# Altium project HPBIController.PrjPCB (part 5 of 8)

## Sheet FPGAPower.SchDoc: 02290_Sonoma_Controller
size B; ApprovedBy: J Johnson; CheckedBy: J Johnson; Author: sdfasdfdfAEFfasdFfaF; DrawnBy: J Johnson; Organization: Opsero Electronic Design; Address1: 21-915 Av. Marguerite-Bourgeoys; Address2: Québec (QC); Address3: G1S 3X4; DocumentNumber: OP009-001-SCH; Revision: D-1; SheetNumber: 12; SheetTotal: 16; Tel1: (581) 308-8830; Tel2: (581) 308-8830; Project: 02290_Sonoma_Controller; CheckedDate: 2013-12-13; Sheet: Zynq Power Supplies; PageSetup: Record=PageOptions|CenterHorizontal=True|CenterVertical=True|PrintScale=1.08|XCorrection=1.00|YCorrection=1.00|PrintKind=0|BorderSize=5000000|LeftOffset=0|BottomOffset=0|Orientation=2|PaperLength=1000|PaperWidth=1000|Scale=100|PaperSource=7|PrintQuality=-4|MediaType=1|DitherType=10|PaperKind=Tabloid     [11 x 17 in]|PrintScaleMode=1; DrawDate: 2013-12-13; SchTitle: 02290_Sonoma_Controller; RevDescription: Replaced Q2,Q3 with STD16NF06LT4; RevDate: 2020-07-07; RevBy: J Johnson; RevDescription2: Added resistors to QSPI interface; ModifiedDate: 2020-07-07
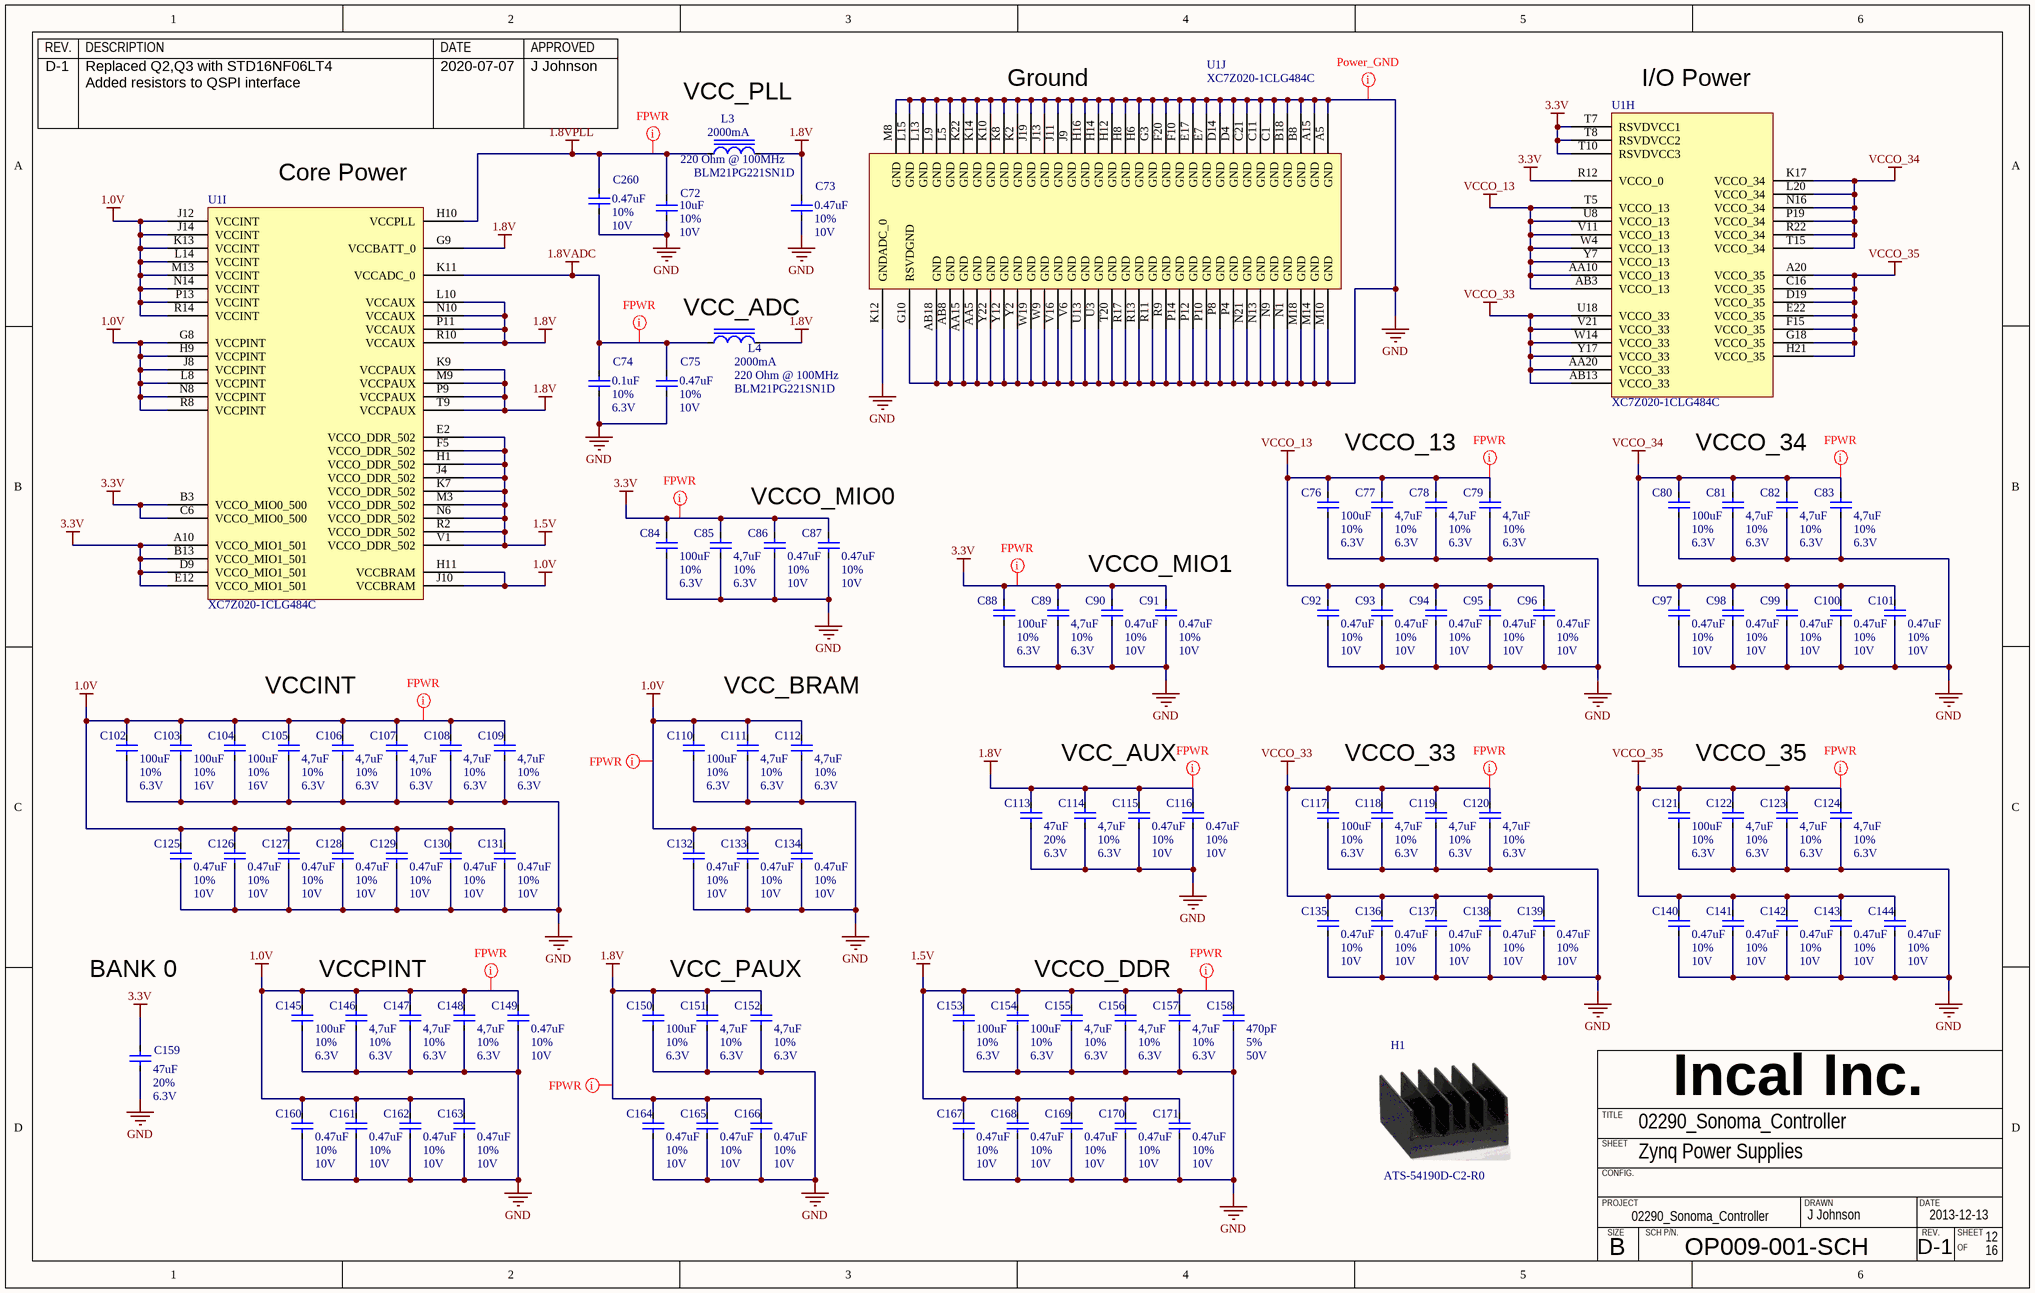
[diagram p8: FPGAPower.SchDoc]

### Parts
C72  value 10uF  Tolerance: 10%  Voltage: 10V  [CAPC1608X38N]  (hidden comment: CAPACITOR_NP_TYPE1)
C73  value 0.47uF  Tolerance: 10%  Voltage: 10V  [CAPC1005X55N]  (hidden comment: CAPACITOR_NP_TYPE1)
C74  value 0.1uF  Tolerance: 10%  Voltage: 6.3V  [CAPC0603X33N]  (hidden comment: CAPACITOR_NP_TYPE1)
C75  value 0.47uF  Tolerance: 10%  Voltage: 10V  [CAPC1005X55N]  (hidden comment: CAPACITOR_NP_TYPE1)
C76  value 100uF  Tolerance: 10%  Voltage: 6.3V  [CAPC3225X250N]  (hidden comment: CAPACITOR_NP_TYPE1)
C77  value 4,7uF  Tolerance: 10%  Voltage: 6.3V  [CAPC1005X33N]  (hidden comment: CAPACITOR_NP_TYPE1)
C78  value 4,7uF  Tolerance: 10%  Voltage: 6.3V  [CAPC1005X33N]  (hidden comment: CAPACITOR_NP_TYPE1)
C79  value 4,7uF  Tolerance: 10%  Voltage: 6.3V  [CAPC1005X33N]  (hidden comment: CAPACITOR_NP_TYPE1)
C80  value 100uF  Tolerance: 10%  Voltage: 6.3V  [CAPC3225X250N]  (hidden comment: CAPACITOR_NP_TYPE1)
C81  value 4,7uF  Tolerance: 10%  Voltage: 6.3V  [CAPC1005X33N]  (hidden comment: CAPACITOR_NP_TYPE1)
C82  value 4,7uF  Tolerance: 10%  Voltage: 6.3V  [CAPC1005X33N]  (hidden comment: CAPACITOR_NP_TYPE1)
C83  value 4,7uF  Tolerance: 10%  Voltage: 6.3V  [CAPC1005X33N]  (hidden comment: CAPACITOR_NP_TYPE1)
C84  value 100uF  Tolerance: 10%  Voltage: 6.3V  [CAPC3225X250N]  (hidden comment: CAPACITOR_NP_TYPE1)
C85  value 4,7uF  Tolerance: 10%  Voltage: 6.3V  [CAPC1005X33N]  (hidden comment: CAPACITOR_NP_TYPE1)
C86  value 0.47uF  Tolerance: 10%  Voltage: 10V  [CAPC1005X55N]  (hidden comment: CAPACITOR_NP_TYPE1)
C87  value 0.47uF  Tolerance: 10%  Voltage: 10V  [CAPC1005X55N]  (hidden comment: CAPACITOR_NP_TYPE1)
C88  value 100uF  Tolerance: 10%  Voltage: 6.3V  [CAPC3225X250N]  (hidden comment: CAPACITOR_NP_TYPE1)
C89  value 4,7uF  Tolerance: 10%  Voltage: 6.3V  [CAPC1005X33N]  (hidden comment: CAPACITOR_NP_TYPE1)
C90  value 0.47uF  Tolerance: 10%  Voltage: 10V  [CAPC1005X55N]  (hidden comment: CAPACITOR_NP_TYPE1)
C91  value 0.47uF  Tolerance: 10%  Voltage: 10V  [CAPC1005X55N]  (hidden comment: CAPACITOR_NP_TYPE1)
C92  value 0.47uF  Tolerance: 10%  Voltage: 10V  [CAPC1005X55N]  (hidden comment: CAPACITOR_NP_TYPE1)
C93  value 0.47uF  Tolerance: 10%  Voltage: 10V  [CAPC1005X55N]  (hidden comment: CAPACITOR_NP_TYPE1)
C94  value 0.47uF  Tolerance: 10%  Voltage: 10V  [CAPC1005X55N]  (hidden comment: CAPACITOR_NP_TYPE1)
C95  value 0.47uF  Tolerance: 10%  Voltage: 10V  [CAPC1005X55N]  (hidden comment: CAPACITOR_NP_TYPE1)
C96  value 0.47uF  Tolerance: 10%  Voltage: 10V  [CAPC1005X55N]  (hidden comment: CAPACITOR_NP_TYPE1)
C97  value 0.47uF  Tolerance: 10%  Voltage: 10V  [CAPC1005X55N]  (hidden comment: CAPACITOR_NP_TYPE1)
C98  value 0.47uF  Tolerance: 10%  Voltage: 10V  [CAPC1005X55N]  (hidden comment: CAPACITOR_NP_TYPE1)
C99  value 0.47uF  Tolerance: 10%  Voltage: 10V  [CAPC1005X55N]  (hidden comment: CAPACITOR_NP_TYPE1)
C100  value 0.47uF  Tolerance: 10%  Voltage: 10V  [CAPC1005X55N]  (hidden comment: CAPACITOR_NP_TYPE1)
C101  value 0.47uF  Tolerance: 10%  Voltage: 10V  [CAPC1005X55N]  (hidden comment: CAPACITOR_NP_TYPE1)
C102  value 100uF  Tolerance: 10%  Voltage: 6.3V  [CAPC3225X250N]  (hidden comment: CAPACITOR_NP_TYPE1)
C103  value 100uF  Tolerance: 10%  Voltage: 16V  [CAPC3225X250N]  (hidden comment: CAPACITOR_NP_TYPE1)
C104  value 100uF  Tolerance: 10%  Voltage: 16V  [CAPC3225X250N]  (hidden comment: CAPACITOR_NP_TYPE1)
C105  value 4,7uF  Tolerance: 10%  Voltage: 6.3V  [CAPC1005X33N]  (hidden comment: CAPACITOR_NP_TYPE1)
C106  value 4,7uF  Tolerance: 10%  Voltage: 6.3V  [CAPC1005X33N]  (hidden comment: CAPACITOR_NP_TYPE1)
C107  value 4,7uF  Tolerance: 10%  Voltage: 6.3V  [CAPC1005X33N]  (hidden comment: CAPACITOR_NP_TYPE1)
C108  value 4,7uF  Tolerance: 10%  Voltage: 6.3V  [CAPC1005X33N]  (hidden comment: CAPACITOR_NP_TYPE1)
C109  value 4,7uF  Tolerance: 10%  Voltage: 6.3V  [CAPC1005X33N]  (hidden comment: CAPACITOR_NP_TYPE1)
C110  value 100uF  Tolerance: 10%  Voltage: 6.3V  [CAPC3225X250N]  (hidden comment: CAPACITOR_NP_TYPE1)
C111  value 4,7uF  Tolerance: 10%  Voltage: 6.3V  [CAPC1005X33N]  (hidden comment: CAPACITOR_NP_TYPE1)
C112  value 4,7uF  Tolerance: 10%  Voltage: 6.3V  [CAPC1005X33N]  (hidden comment: CAPACITOR_NP_TYPE1)
C113  value 47uF  Tolerance: 20%  Voltage: 6.3V  [CAPC2013X125N]  (hidden comment: CAPACITOR_NP_TYPE1)
C114  value 4,7uF  Tolerance: 10%  Voltage: 6.3V  [CAPC1005X33N]  (hidden comment: CAPACITOR_NP_TYPE1)
C115  value 0.47uF  Tolerance: 10%  Voltage: 10V  [CAPC1005X55N]  (hidden comment: CAPACITOR_NP_TYPE1)
C116  value 0.47uF  Tolerance: 10%  Voltage: 10V  [CAPC1005X55N]  (hidden comment: CAPACITOR_NP_TYPE1)
C117  value 100uF  Tolerance: 10%  Voltage: 6.3V  [CAPC3225X250N]  (hidden comment: CAPACITOR_NP_TYPE1)
C118  value 4,7uF  Tolerance: 10%  Voltage: 6.3V  [CAPC1005X33N]  (hidden comment: CAPACITOR_NP_TYPE1)
C119  value 4,7uF  Tolerance: 10%  Voltage: 6.3V  [CAPC1005X33N]  (hidden comment: CAPACITOR_NP_TYPE1)
C120  value 4,7uF  Tolerance: 10%  Voltage: 6.3V  [CAPC1005X33N]  (hidden comment: CAPACITOR_NP_TYPE1)
C121  value 100uF  Tolerance: 10%  Voltage: 6.3V  [CAPC3225X250N]  (hidden comment: CAPACITOR_NP_TYPE1)
C122  value 4,7uF  Tolerance: 10%  Voltage: 6.3V  [CAPC1005X33N]  (hidden comment: CAPACITOR_NP_TYPE1)
C123  value 4,7uF  Tolerance: 10%  Voltage: 6.3V  [CAPC1005X33N]  (hidden comment: CAPACITOR_NP_TYPE1)
C124  value 4,7uF  Tolerance: 10%  Voltage: 6.3V  [CAPC1005X33N]  (hidden comment: CAPACITOR_NP_TYPE1)
C125  value 0.47uF  Tolerance: 10%  Voltage: 10V  [CAPC1005X55N]  (hidden comment: CAPACITOR_NP_TYPE1)
C126  value 0.47uF  Tolerance: 10%  Voltage: 10V  [CAPC1005X55N]  (hidden comment: CAPACITOR_NP_TYPE1)
C127  value 0.47uF  Tolerance: 10%  Voltage: 10V  [CAPC1005X55N]  (hidden comment: CAPACITOR_NP_TYPE1)
C128  value 0.47uF  Tolerance: 10%  Voltage: 10V  [CAPC1005X55N]  (hidden comment: CAPACITOR_NP_TYPE1)
C129  value 0.47uF  Tolerance: 10%  Voltage: 10V  [CAPC1005X55N]  (hidden comment: CAPACITOR_NP_TYPE1)
C130  value 0.47uF  Tolerance: 10%  Voltage: 10V  [CAPC1005X55N]  (hidden comment: CAPACITOR_NP_TYPE1)
C131  value 0.47uF  Tolerance: 10%  Voltage: 10V  [CAPC1005X55N]  (hidden comment: CAPACITOR_NP_TYPE1)
C132  value 0.47uF  Tolerance: 10%  Voltage: 10V  [CAPC1005X55N]  (hidden comment: CAPACITOR_NP_TYPE1)
C133  value 0.47uF  Tolerance: 10%  Voltage: 10V  [CAPC1005X55N]  (hidden comment: CAPACITOR_NP_TYPE1)
C134  value 0.47uF  Tolerance: 10%  Voltage: 10V  [CAPC1005X55N]  (hidden comment: CAPACITOR_NP_TYPE1)
C135  value 0.47uF  Tolerance: 10%  Voltage: 10V  [CAPC1005X55N]  (hidden comment: CAPACITOR_NP_TYPE1)
C136  value 0.47uF  Tolerance: 10%  Voltage: 10V  [CAPC1005X55N]  (hidden comment: CAPACITOR_NP_TYPE1)
C137  value 0.47uF  Tolerance: 10%  Voltage: 10V  [CAPC1005X55N]  (hidden comment: CAPACITOR_NP_TYPE1)
C138  value 0.47uF  Tolerance: 10%  Voltage: 10V  [CAPC1005X55N]  (hidden comment: CAPACITOR_NP_TYPE1)
C139  value 0.47uF  Tolerance: 10%  Voltage: 10V  [CAPC1005X55N]  (hidden comment: CAPACITOR_NP_TYPE1)
C140  value 0.47uF  Tolerance: 10%  Voltage: 10V  [CAPC1005X55N]  (hidden comment: CAPACITOR_NP_TYPE1)
C141  value 0.47uF  Tolerance: 10%  Voltage: 10V  [CAPC1005X55N]  (hidden comment: CAPACITOR_NP_TYPE1)
C142  value 0.47uF  Tolerance: 10%  Voltage: 10V  [CAPC1005X55N]  (hidden comment: CAPACITOR_NP_TYPE1)
C143  value 0.47uF  Tolerance: 10%  Voltage: 10V  [CAPC1005X55N]  (hidden comment: CAPACITOR_NP_TYPE1)
C144  value 0.47uF  Tolerance: 10%  Voltage: 10V  [CAPC1005X55N]  (hidden comment: CAPACITOR_NP_TYPE1)
C145  value 100uF  Tolerance: 10%  Voltage: 6.3V  [CAPC3225X250N]  (hidden comment: CAPACITOR_NP_TYPE1)
C146  value 4,7uF  Tolerance: 10%  Voltage: 6.3V  [CAPC1005X33N]  (hidden comment: CAPACITOR_NP_TYPE1)
C147  value 4,7uF  Tolerance: 10%  Voltage: 6.3V  [CAPC1005X33N]  (hidden comment: CAPACITOR_NP_TYPE1)
C148  value 4,7uF  Tolerance: 10%  Voltage: 6.3V  [CAPC1005X33N]  (hidden comment: CAPACITOR_NP_TYPE1)
C149  value 0.47uF  Tolerance: 10%  Voltage: 10V  [CAPC1005X55N]  (hidden comment: CAPACITOR_NP_TYPE1)
C150  value 100uF  Tolerance: 10%  Voltage: 6.3V  [CAPC3225X250N]  (hidden comment: CAPACITOR_NP_TYPE1)
C151  value 4,7uF  Tolerance: 10%  Voltage: 6.3V  [CAPC1005X33N]  (hidden comment: CAPACITOR_NP_TYPE1)
C152  value 4,7uF  Tolerance: 10%  Voltage: 6.3V  [CAPC1005X33N]  (hidden comment: CAPACITOR_NP_TYPE1)
C153  value 100uF  Tolerance: 10%  Voltage: 6.3V  [CAPC3225X250N]  (hidden comment: CAPACITOR_NP_TYPE1)
C154  value 100uF  Tolerance: 10%  Voltage: 6.3V  [CAPC3225X250N]  (hidden comment: CAPACITOR_NP_TYPE1)
C155  value 4,7uF  Tolerance: 10%  Voltage: 6.3V  [CAPC1005X33N]  (hidden comment: CAPACITOR_NP_TYPE1)
C156  value 4,7uF  Tolerance: 10%  Voltage: 6.3V  [CAPC1005X33N]  (hidden comment: CAPACITOR_NP_TYPE1)
C157  value 4,7uF  Tolerance: 10%  Voltage: 6.3V  [CAPC1005X33N]  (hidden comment: CAPACITOR_NP_TYPE1)
C158  value 470pF  Tolerance: 5%  Voltage: 50V  [CAPC1005X33N]  (hidden comment: CAPACITOR_NP_TYPE1)
C159  value 47uF  Tolerance: 20%  Voltage: 6.3V  [CAPC2013X125N]  (hidden comment: CAPACITOR_NP_TYPE1)
C160  value 0.47uF  Tolerance: 10%  Voltage: 10V  [CAPC1005X55N]  (hidden comment: CAPACITOR_NP_TYPE1)
C161  value 0.47uF  Tolerance: 10%  Voltage: 10V  [CAPC1005X55N]  (hidden comment: CAPACITOR_NP_TYPE1)
C162  value 0.47uF  Tolerance: 10%  Voltage: 10V  [CAPC1005X55N]  (hidden comment: CAPACITOR_NP_TYPE1)
C163  value 0.47uF  Tolerance: 10%  Voltage: 10V  [CAPC1005X55N]  (hidden comment: CAPACITOR_NP_TYPE1)
C164  value 0.47uF  Tolerance: 10%  Voltage: 10V  [CAPC1005X55N]  (hidden comment: CAPACITOR_NP_TYPE1)
C165  value 0.47uF  Tolerance: 10%  Voltage: 10V  [CAPC1005X55N]  (hidden comment: CAPACITOR_NP_TYPE1)
C166  value 0.47uF  Tolerance: 10%  Voltage: 10V  [CAPC1005X55N]  (hidden comment: CAPACITOR_NP_TYPE1)
C167  value 0.47uF  Tolerance: 10%  Voltage: 10V  [CAPC1005X55N]  (hidden comment: CAPACITOR_NP_TYPE1)
C168  value 0.47uF  Tolerance: 10%  Voltage: 10V  [CAPC1005X55N]  (hidden comment: CAPACITOR_NP_TYPE1)
C169  value 0.47uF  Tolerance: 10%  Voltage: 10V  [CAPC1005X55N]  (hidden comment: CAPACITOR_NP_TYPE1)
C170  value 0.47uF  Tolerance: 10%  Voltage: 10V  [CAPC1005X55N]  (hidden comment: CAPACITOR_NP_TYPE1)
C171  value 0.47uF  Tolerance: 10%  Voltage: 10V  [CAPC1005X55N]  (hidden comment: CAPACITOR_NP_TYPE1)
C260  value 0.47uF  Tolerance: 10%  Voltage: 10V  [CAPC1005X55N]  (hidden comment: CAPACITOR_NP_TYPE1)
H1  ATS-54190D-C2-R0  (mechanical)
L3  value 220 Ohm @ 100MHz  Current: 2000mA  Mfg Part Number 1: BLM21PG221SN1D  [INDC2012X85N]  (hidden comment: INDUCTOR_CORE_TYPE1)
L4  value 220 Ohm @ 100MHz  Current: 2000mA  Mfg Part Number 1: BLM21PG221SN1D  [INDC2012X85N]  (hidden comment: INDUCTOR_CORE_TYPE1)
U1  XC7Z020-1CLG484C  [CLG484]  (parts H,I,J of 10)

### Nets
1.0V: C102.1 C103.1 C104.1 C105.1 C106.1 C107.1 C108.1 C109.1 C110.1 C111.1 C112.1 C125.1 C126.1 C127.1 C128.1 C129.1 C130.1 C131.1 C132.1 C133.1 C134.1 C145.1 C146.1 C147.1 C148.1 C149.1 C160.1 C161.1 C162.1 C163.1 U1.G8(VCCPINT) U1.H9(VCCPINT) U1.H11(VCCBRAM) U1.J8(VCCPINT) U1.J10(VCCBRAM) U1.J12(VCCINT) U1.J14(VCCINT) U1.K13(VCCINT) U1.L8(VCCPINT) U1.L14(VCCINT) U1.M13(VCCINT) U1.N8(VCCPINT) U1.N14(VCCINT) U1.P13(VCCINT) U1.R8(VCCPINT) U1.R14(VCCINT)
1.5V: C153.1 C154.1 C155.1 C156.1 C157.1 C158.1 C167.1 C168.1 C169.1 C170.1 C171.1 U1.E2(VCCO_DDR_502) U1.F5(VCCO_DDR_502) U1.H1(VCCO_DDR_502) U1.J4(VCCO_DDR_502) U1.K7(VCCO_DDR_502) U1.M3(VCCO_DDR_502) U1.N6(VCCO_DDR_502) U1.R2(VCCO_DDR_502) U1.V1(VCCO_DDR_502)
1.8V: C73.1 C113.1 C114.1 C115.1 C116.1 C150.1 C151.1 C152.1 C164.1 C165.1 C166.1 L3.2 L4.2 U1.G9(VCCBATT_0) U1.K9(VCCPAUX) U1.L10(VCCAUX) U1.M9(VCCPAUX) U1.N10(VCCAUX) U1.P9(VCCPAUX) U1.P11(VCCAUX) U1.R10(VCCAUX) U1.T9(VCCPAUX)
1.8VADC: C74.1 C75.1 L4.1 U1.K11(VCCADC_0)
1.8VPLL: C72.1 C260.1 L3.1 U1.H10(VCCPLL)
3.3V: C84.1 C85.1 C86.1 C87.1 C88.1 C89.1 C90.1 C91.1 C159.1 U1.A10(VCCO_MIO1_501) U1.B3(VCCO_MIO0_500) U1.B13(VCCO_MIO1_501) U1.C6(VCCO_MIO0_500) U1.D9(VCCO_MIO1_501) U1.E12(VCCO_MIO1_501) U1.R12(VCCO_0) U1.T7(RSVDVCC1) U1.T8(RSVDVCC2) U1.T10(RSVDVCC3)
GND: C72.2 C73.2 C74.2 C75.2 C76.2 C77.2 C78.2 C79.2 C80.2 C81.2 C82.2 C83.2 C84.2 C85.2 C86.2 C87.2 C88.2 C89.2 C90.2 C91.2 C92.2 C93.2 C94.2 C95.2 C96.2 C97.2 C98.2 C99.2 C100.2 C101.2 C102.2 C103.2 C104.2 C105.2 C106.2 C107.2 C108.2 C109.2 C110.2 C111.2 C112.2 C113.2 C114.2 C115.2 C116.2 C117.2 C118.2 C119.2 C120.2 C121.2 C122.2 C123.2 C124.2 C125.2 C126.2 C127.2 C128.2 C129.2 C130.2 C131.2 C132.2 C133.2 C134.2 C135.2 C136.2 C137.2 C138.2 C139.2 C140.2 C141.2 C142.2 C143.2 C144.2 C145.2 C146.2 C147.2 C148.2 C149.2 C150.2 C151.2 C152.2 C153.2 C154.2 C155.2 C156.2 C157.2 C158.2 C159.2 C160.2 C161.2 C162.2 C163.2 C164.2 C165.2 C166.2 C167.2 C168.2 C169.2 C170.2 C171.2 C260.2 U1.A5(GND) U1.A15(GND) U1.AA5(GND) U1.AA15(GND) U1.AB8(GND) U1.AB18(GND) U1.B8(GND) U1.B18(GND) U1.C1(GND) U1.C11(GND) U1.C21(GND) U1.D4(GND) U1.D14(GND) U1.E7(GND) U1.E17(GND) U1.F10(GND) U1.F20(GND) U1.G3(GND) U1.G10(RSVDGND) U1.H6(GND) U1.H8(GND) U1.H12(GND) U1.H14(GND) U1.H16(GND) U1.J9(GND) U1.J11(GND) U1.J13(GND) U1.J19(GND) U1.K2(GND) U1.K8(GND) U1.K10(GND) U1.K12(GNDADC_0) U1.K14(GND) U1.K22(GND) U1.L5(GND) U1.L9(GND) U1.L13(GND) U1.L15(GND) U1.M8(GND) U1.M10(GND) U1.M14(GND) U1.M18(GND) U1.N1(GND) U1.N9(GND) U1.N13(GND) U1.N21(GND) U1.P4(GND) U1.P8(GND) U1.P10(GND) U1.P12(GND) U1.P14(GND) U1.R9(GND) U1.R11(GND) U1.R13(GND) U1.R17(GND) U1.T20(GND) U1.U3(GND) U1.U13(GND) U1.V6(GND) U1.V16(GND) U1.W9(GND) U1.W19(GND) U1.Y2(GND) U1.Y12(GND) U1.Y22(GND)
VCCO_13: C76.1 C77.1 C78.1 C79.1 C92.1 C93.1 C94.1 C95.1 C96.1 U1.AA10(VCCO_13) U1.AB3(VCCO_13) U1.T5(VCCO_13) U1.U8(VCCO_13) U1.V11(VCCO_13) U1.W4(VCCO_13) U1.Y7(VCCO_13)
VCCO_33: C117.1 C118.1 C119.1 C120.1 C135.1 C136.1 C137.1 C138.1 C139.1 U1.AA20(VCCO_33) U1.AB13(VCCO_33) U1.U18(VCCO_33) U1.V21(VCCO_33) U1.W14(VCCO_33) U1.Y17(VCCO_33)
VCCO_34: C80.1 C81.1 C82.1 C83.1 C97.1 C98.1 C99.1 C100.1 C101.1 U1.K17(VCCO_34) U1.L20(VCCO_34) U1.N16(VCCO_34) U1.P19(VCCO_34) U1.R22(VCCO_34) U1.T15(VCCO_34)
VCCO_35: C121.1 C122.1 C123.1 C124.1 C140.1 C141.1 C142.1 C143.1 C144.1 U1.A20(VCCO_35) U1.C16(VCCO_35) U1.D19(VCCO_35) U1.E22(VCCO_35) U1.F15(VCCO_35) U1.G18(VCCO_35) U1.H21(VCCO_35)

### Layout directives
net class Power_FPGA: 1.0V, 1.5V, 1.8V, 1.8VADC, 1.8VPLL, 3.3V, VCCO_13, VCCO_33, VCCO_34, VCCO_35
net class Power_GND: GND

### Notes on the sheet
- (near L3) VCC_PLL
- Ground
- (near U1) I/O Power
- (near U1) Core Power
- (near L4) VCC_ADC
- VCCO_MIO0
- VCCO_13
- VCCO_34
- VCCO_MIO1
- VCCINT
- VCC_BRAM
- VCC_AUX
- VCCO_33
- VCCO_35
- BANK 0
- VCCPINT
- VCC_PAUX
- VCCO_DDR
- REV.
- DESCRIPTION
- DATE
- APPROVED
- Incal Inc.
- SHEET
- TITLE
- CONFIG.
- PROJECT
- SIZE
- SCH P/N.
- DRAWN
- B
- OF

### Library data of the parts
C72 = C0603_10uF_10%_10V_X5R: Capacitor ceramic, X5R, 10uF, 10V, 10%, -55 to +85 C, EIA0603; Manufacturer 1: TDK Corporation; Mfg Part Number 1: C1608X5R1A106K080AC; EIA(I) Package: 0603; EIA(M) Package: 1608; ASSY: USED; Status: Active; Power: *; Current: *; Part Ref: C0603_10uF_10%_10V_X5R; Comment_1: *; RoHs: True; Operating Temp: -55 to +85 C
C73 C75 C86 C87 C90-C101 C115 C116 C125-C144 C149 C160-C171 C260 = C0402_0.47uF_10%_10V_X5R: Capacitor ceramic, X5R, 0.47uF, 10V, 10%, -55 to +85 C, EIA0402; Manufacturer 1: MURATA; Mfg Part Number 1: GRM155R61A474KE15D; EIA(I) Package: 0402; EIA(M) Package: 1005; ASSY: USED; Status: Active; Power: *; Current: *; Part Ref: C0402_0.47uF_10%_10V_X5R; Comment_1: *; RoHs: True; Operating Temp: -55 to +85 C; Datasheet 1: ..\datasheet\Capacitor\Murata\GRM_Serie\GRM155R61A_X5R\2012-10-27
C74 = C0201_0.1uF_10%_6.3V_X5R: Capacitor ceramic, X5R, 0.1uF, 6.3V, 10%, -55 to +125 C, EIA0201; Manufacturer 1: Murata; Mfg Part Number 1: GRM033R60J104KE19D; EIA(I) Package: 0201; EIA(M) Package: 0603; ASSY: USED; Status: Active; Power: *; Current: *; Part Ref: C0201_0.1uF_10%_6.3V_X5R; Comment_1: *; RoHs: True; Operating Temp: -55 to +85 C
C76 C80 C84 C88 C102 C110 C117 C121 C145 C150 C153 C154 = C1210_100uF_10%_6.3V_X5R: Capacitor ceramic, X5R, 100uF, 6.3V, 10%, -55 to +85 C, EIA1210; Manufacturer 1: Murata; Mfg Part Number 1: GRM32EF50J107ZE20K; EIA(I) Package: 1210; EIA(M) Package: 3225; ASSY: USED; Status: Active; Power: *; Current: *; Part Ref: C1210_100uF_10%_6.3V_X5R; Comment_1: *; RoHs: True; Operating Temp: -55 to +85 C; Datasheet 1: ..\datasheet\Capacitor\Murata\GRM_Serie\GRM32ER60J_X5R\2012-10-25
C77-C79 C81-C83 C85 C89 C105-C109 C111 C112 C114 C118-C120 C122-C124 C146-C148 C151 C152 C155-C157 = C0402_4.7uF_20%_6.3V_X7R: Capacitor ceramic, X5R, 4,7uF, 6.3V, 10%, -55 to +85 C, EIA0402; Manufacturer 1: TDK; Mfg Part Number 1: C1005X5R0J475K; EIA(I) Package: 0402; EIA(M) Package: 1005; ASSY: USED; Status: Active; Power: *; Current: *; Part Ref: C0402_4.7uF_20%_6.3V_X7R; Comment_1: *; RoHs: True; Operating Temp: -55 to +85 C; Datasheet 1: ..\datasheet\Capacitor\TDK\C Series\2012-10-25
C103 C104 = C1210_100uF_10%_16V_X5R: Capacitor ceramic, X5R, 100uF, 16V, 10%, -55 to +85 C, EIA1210; Manufacturer 1: Taiyo; Mfg Part Number 1: EMK325ABJ107MM-T; EIA(I) Package: 1210; EIA(M) Package: 3225; ASSY: USED; Status: Active; Power: *; Current: *; Part Ref: C1210_100uF_10%_16V_X5R; Comment_1: *; RoHs: True; Operating Temp: -55 to +85 C; Datasheet 1: ..\datasheet\Capacitor\Murata\GRM_Serie\GRM32ER60J_X5R\2012-10-25
C113 C159 = C0805_47uF_10%_25V_X5R: Capacitor ceramic, X5R, 47uF, 6.3V, 20%, -55 to +85 C,; Manufacturer 1: Taiyo; Mfg Part Number 1: JMK212BJ476MG-T; EIA(I) Package: 0805; EIA(M) Package: 2012; ASSY: USED; Status: Active; Power: *; Current: *; Part Ref: C0805_47uF_10%_25V_X5R; Comment_1: *; RoHs: True; Operating Temp: -55 to +85 C
C158 = C0402_470pF_5%_50V_C0G: Capacitor ceramic, C0G (NP0), 470pF, 50V, 5%, -55 to +125 C, EIA0402; Manufacturer 1: Murata; Mfg Part Number 1: GRM1555C1H471JA01D; EIA(I) Package: 0402; EIA(M) Package: 1005; ASSY: USED; Status: Active; Power: *; Current: *; Part Ref: C0402_470pF_5%_50V_C0G; Comment_1: *; RoHs: True; Operating Temp: -55 to +125 C; Datasheet 1: ..\datasheet\Capacitor\Murata\GRM_Serie\Series catalog\2013-04-30
H1 = HSINK-19X19X9.5: Heat Sink BGA, 19x19x9.5mm, Adhesive; Manufacturer 1: Advanced Thermal Solutions; ASSY: USED; Power: Pow; Current: Cur; Voltage: Vol; Comment_1: Com; Status: Active; EIA(I) Package: *; EIA(M) Package: *; Part Ref: HSINK-19X19X9.5; Tolerance: *; Package: *; RoHs: True; Value: ATS-54190D-C2-R0; Mfg Part Number 1: ATS-54190D-C2-R0
L3 L4 = BLM21PG221SN1D: Ferrite chip, 220 Ohm @ 100MHz, 2000mA, 25%, -55 to +125 C, 0805; Manufacturer 1: Murata; EIA(I) Package: 0805; EIA(M) Package: 2012; ASSY: USED; Status: Active; Power: *; Part Ref: BLM21PG221SN1D; Voltage: *; Comment_1: *; RoHs: True; Tolerance: 25%; Operating Temp: -55 to +125 C
U1 = XC7Z020-1CLG484C: 667 MHz Zynq™-7000 AP SoC, 130 PS I/O, 200 FPGA I/O, 484-Ball BGA, Speed Grade 1, Commercial Grade; Manufacturer: Xilinx; Extensible Block RAM (# 36Kb Blocks): 560 KB (140); Flip Flops: 106400; LUTs: 53200; Speed Grade: -1; DatasheetVersion: v1.2; PackageVersion: Rev 1.1; PackageReference: CLG484; PackageDescription: Wire-Bond Chip-Scale BGA, Body 19 x 19 mm, 0.8 mm Pitch; Generic Part Number: XC7Z020; RoHS: True; Mounting Technology: Surface Mount; Code_JEDEC: MO-275-PPAA-2; PartNumber: XC7Z020-1CLG484C; ComponentLink1Description: Datasheet; ComponentLink1URL: http://www.xilinx.com/support/documentation/data_sheets/ds190-Zynq-7000-Overview.pdf; ComponentLink2Description: Package Specification; ComponentLink2URL: http://www.xilinx.com/support/documentation/user_guides/ug865-Zynq-7000-Pkg-Pinout.pdf; ComponentLink3Description: DC and AC Switching Characteristics; ComponentLink3URL: http://www.xilinx.com/support/documentation/data_sheets/ds187-XC7Z010-XC7Z020-Data-Sheet.pdf; ComponentLink4Description: Package File; ComponentLink4URL: http://www.xilinx.com/support/packagefiles/z7packages/xc7z020clg484pkg.txt; ComponentLink5Description: Packaging and Pinout; ComponentLink5URL: http://www.xilinx.com/support/documentation/user_guides/ug865-Zynq-7000-Pkg-Pinout.pdf; ComponentLink6Description: PCB and Layout Guide; ComponentLink6URL: http://www.xilinx.com/support/documentation/user_guides/ug483_7Series_PCB.pdf; Part Ref: XC7Z020-1CLG484C; Status: Active; Value: XC7Z020-1CLG484C; Manufacturer 1: Xilinx; Mfg Part Number 1: XC7Z020-1CLG484C; Package: CLG484

## Sheet HeaderA.SchDoc: 02290_Sonoma_Controller
size B; ApprovedBy: J Johnson; CheckedBy: J Johnson; Author: sdfasdfdfAEFfasdFfaF; DrawnBy: J Johnson; Organization: Opsero Electronic Design; Address1: 21-915 Av. Marguerite-Bourgeoys; Address2: Québec (QC); Address3: G1S 3X4; DocumentNumber: OP009-001-SCH; Revision: D-1; SheetNumber: 09; SheetTotal: 16; Tel1: (581) 308-8830; Tel2: (581) 308-8830; Project: 02290_Sonoma_Controller; CheckedDate: yyyy-mm-dd; Sheet: Header A; PageSetup: Record=PageOptions|CenterHorizontal=True|CenterVertical=True|PrintScale=1.08|XCorrection=1.00|YCorrection=1.00|PrintKind=0|BorderSize=5000000|LeftOffset=0|BottomOffset=0|Orientation=2|PaperLength=1000|PaperWidth=1000|Scale=100|PaperSource=7|PrintQuality=-4|MediaType=1|DitherType=10|PaperKind=Tabloid     [11 x 17 in]|PrintScaleMode=1; DrawDate: 2013-12-13; SchTitle: 02290_Sonoma_Controller; RevDescription: Replaced Q2,Q3 with STD16NF06LT4; RevDate: 2020-07-07; RevBy: J Johnson; RevDescription2: Added resistors to QSPI interface; ModifiedDate: 2020-07-07
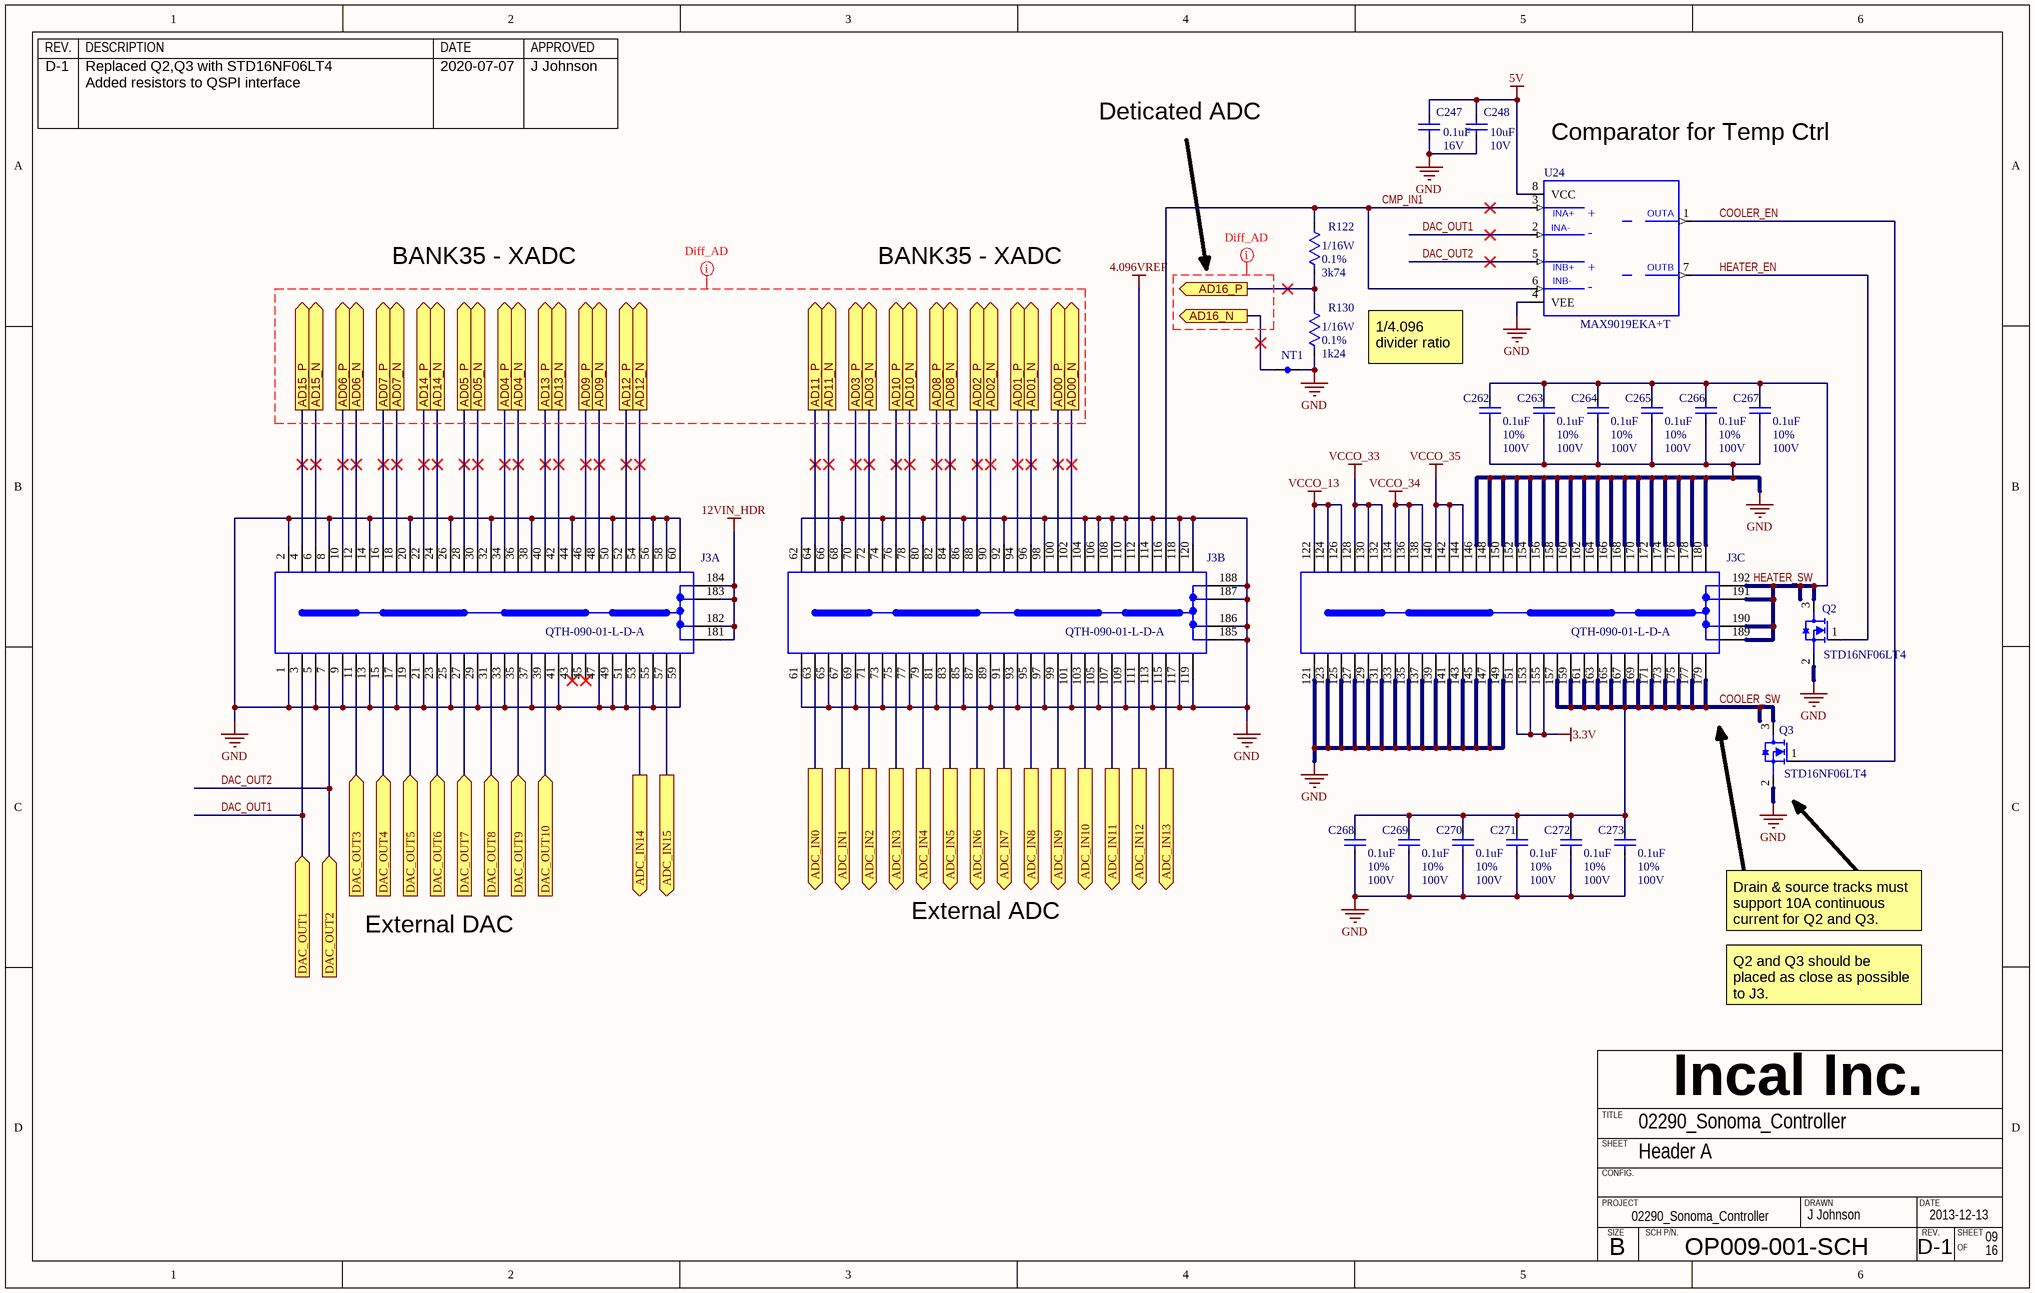
[diagram p9: HeaderA.SchDoc]

### Parts
C247  value 0.1uF  Voltage: 16V  [CAPC1005X33N]  (hidden comment: CAPACITOR_NP_TYPE1)
C248  value 10uF  Voltage: 10V  [CAPC1608X38N]  (hidden comment: CAPACITOR_NP_TYPE1)
C262  value 0.1uF  Tolerance: 10%  Voltage: 100V  [CAPC1608X38N]  (hidden comment: CAPACITOR_NP_TYPE1)
C263  value 0.1uF  Tolerance: 10%  Voltage: 100V  [CAPC1608X38N]  (hidden comment: CAPACITOR_NP_TYPE1)
C264  value 0.1uF  Tolerance: 10%  Voltage: 100V  [CAPC1608X38N]  (hidden comment: CAPACITOR_NP_TYPE1)
C265  value 0.1uF  Tolerance: 10%  Voltage: 100V  [CAPC1608X38N]  (hidden comment: CAPACITOR_NP_TYPE1)
C266  value 0.1uF  Tolerance: 10%  Voltage: 100V  [CAPC1608X38N]  (hidden comment: CAPACITOR_NP_TYPE1)
C267  value 0.1uF  Tolerance: 10%  Voltage: 100V  [CAPC1608X38N]  (hidden comment: CAPACITOR_NP_TYPE1)
C268  value 0.1uF  Tolerance: 10%  Voltage: 100V  [CAPC1608X38N]  (hidden comment: CAPACITOR_NP_TYPE1)
C269  value 0.1uF  Tolerance: 10%  Voltage: 100V  [CAPC1608X38N]  (hidden comment: CAPACITOR_NP_TYPE1)
C270  value 0.1uF  Tolerance: 10%  Voltage: 100V  [CAPC1608X38N]  (hidden comment: CAPACITOR_NP_TYPE1)
C271  value 0.1uF  Tolerance: 10%  Voltage: 100V  [CAPC1608X38N]  (hidden comment: CAPACITOR_NP_TYPE1)
C272  value 0.1uF  Tolerance: 10%  Voltage: 100V  [CAPC1608X38N]  (hidden comment: CAPACITOR_NP_TYPE1)
C273  value 0.1uF  Tolerance: 10%  Voltage: 100V  [CAPC1608X38N]  (hidden comment: CAPACITOR_NP_TYPE1)
J3  QTH-090-01-L-D-A  [QTH-090-01-L-D-A]  (parts A,B,C of 3)
NT1  NET_TIE_1X1  [NET_TIE_1X1]  (value not drawn)  (net tie, no BOM)
Q2  value STD16NF06LT4  [TO228P1041X238-3N]  (hidden comment: TRANS_MOSFET_N-CH_TYPE2)
Q3  value STD16NF06LT4  [TO228P1041X238-3N]  (hidden comment: TRANS_MOSFET_N-CH_TYPE2)
R122  value 3k74  Power: 1/16W  Tolerance: 0.1%  [RESC1005X33N]  (hidden comment: *)
R130  value 1k24  Power: 1/16W  Tolerance: 0.1%  [RESC1005X33N]  (hidden comment: *)
U24  value MAX9019EKA+T  [SOT65P280X145-8AN]  (hidden comment: MAX9019)

### Ports
AD00_N (out), AD00_P (out), AD01_N (out), AD01_P (out), AD02_N (out), AD02_P (out), AD03_N (out), AD03_P (out), AD04_N (out), AD04_P (out), AD05_N (out), AD05_P (out), AD06_N (out), AD06_P (out), AD07_N (out), AD07_P (out), AD08_N (out), AD08_P (out), AD09_N (out), AD09_P (out), AD10_N (out), AD10_P (out), AD11_N (out), AD11_P (out), AD12_N (out), AD12_P (out), AD13_N (out), AD13_P (out), AD14_N (out), AD14_P (out), AD15_N (out), AD15_P (out), AD16_N (out), AD16_P (out), ADC_IN0 (out), ADC_IN1 (out), ADC_IN2 (out), ADC_IN3 (out), ADC_IN4 (out), ADC_IN5 (out), ADC_IN6 (out), ADC_IN7 (out), ADC_IN8 (out), ADC_IN9 (out), ADC_IN10 (out), ADC_IN11 (out), ADC_IN12 (out), ADC_IN13 (out), ADC_IN14 (out), ADC_IN15 (out), DAC_OUT1 (in), DAC_OUT2 (in), DAC_OUT3 (in), DAC_OUT4 (in), DAC_OUT5 (in), DAC_OUT6 (in), DAC_OUT7 (in), DAC_OUT8 (in), DAC_OUT9 (in), DAC_OUT10 (in)

### Nets
3.3V: J3.151 J3.153 J3.155
4.096VREF: J3.112
5V: C247.1 C248.1 U24.8(VCC)
12VIN_HDR: J3.181 J3.182 J3.183 J3.184
GND: C247.2 C248.2 C262.2 C263.2 C264.2 C265.2 C266.2 C267.2 C268.2 C269.2 C270.2 C271.2 C272.2 C273.2 J3.1 J3.2 J3.5 J3.8 J3.9 J3.13 J3.14 J3.17 J3.20 J3.21 J3.25 J3.26 J3.29 J3.32 J3.33 J3.37 J3.38 J3.41 J3.44 J3.47 J3.49 J3.50 J3.51 J3.55 J3.56 J3.58 J3.59 J3.60 J3.61 J3.62 J3.65 J3.68 J3.69 J3.73 J3.74 J3.77 J3.80 J3.81 J3.85 J3.86 J3.89 J3.92 J3.93 J3.97 J3.98 J3.101 J3.104 J3.105 J3.106 J3.108 J3.109 J3.110 J3.113 J3.114 J3.117 J3.118 J3.119 J3.120 J3.121 J3.123 J3.125 J3.127 J3.129 J3.131 J3.133 J3.135 J3.137 J3.139 J3.141 J3.143 J3.145 J3.146 J3.147 J3.148 J3.149 J3.150 J3.152 J3.154 J3.156 J3.158 J3.160 J3.162 J3.164 J3.166 J3.168 J3.170 J3.172 J3.174 J3.176 J3.178 J3.180 J3.185 J3.186 J3.187 J3.188 NT1.2 Q2.2(S) Q3.2(S) R130.2 U24.4(VEE)
VCCO_13: J3.122 J3.124 J3.126
VCCO_33: J3.128 J3.130 J3.132
VCCO_34: J3.134 J3.136 J3.138
VCCO_35: J3.140 J3.142 J3.144
AD00_N: J3.102 ; port AD00_N
AD00_P: J3.100 ; port AD00_P
AD01_N: J3.96 ; port AD01_N
AD01_P: J3.94 ; port AD01_P
AD02_N: J3.90 ; port AD02_N
AD02_P: J3.88 ; port AD02_P
AD03_N: J3.72 ; port AD03_N
AD03_P: J3.70 ; port AD03_P
AD04_N: J3.36 ; port AD04_N
AD04_P: J3.34 ; port AD04_P
AD05_N: J3.30 ; port AD05_N
AD05_P: J3.28 ; port AD05_P
AD06_N: J3.12 ; port AD06_N
AD06_P: J3.10 ; port AD06_P
AD07_N: J3.18 ; port AD07_N
AD07_P: J3.16 ; port AD07_P
AD08_N: J3.84 ; port AD08_N
AD08_P: J3.82 ; port AD08_P
AD09_N: J3.48 ; port AD09_N
AD09_P: J3.46 ; port AD09_P
AD10_N: J3.78 ; port AD10_N
AD10_P: J3.76 ; port AD10_P
AD11_N: J3.66 ; port AD11_N
AD11_P: J3.64 ; port AD11_P
AD12_N: J3.54 ; port AD12_N
AD12_P: J3.52 ; port AD12_P
AD13_N: J3.42 ; port AD13_N
AD13_P: J3.40 ; port AD13_P
AD14_N: J3.24 ; port AD14_N
AD14_P: J3.22 ; port AD14_P
AD15_N: J3.6 ; port AD15_N
AD15_P: J3.4 ; port AD15_P
AD16_N: NT1.1 ; port AD16_N
AD16_P: R122.2 R130.1 ; port AD16_P
ADC_IN0: J3.63 ; port ADC_IN0
ADC_IN1: J3.67 ; port ADC_IN1
ADC_IN2: J3.71 ; port ADC_IN2
ADC_IN3: J3.75 ; port ADC_IN3
ADC_IN4: J3.79 ; port ADC_IN4
ADC_IN5: J3.83 ; port ADC_IN5
ADC_IN6: J3.87 ; port ADC_IN6
ADC_IN7: J3.91 ; port ADC_IN7
ADC_IN8: J3.95 ; port ADC_IN8
ADC_IN9: J3.99 ; port ADC_IN9
ADC_IN10: J3.103 ; port ADC_IN10
ADC_IN11: J3.107 ; port ADC_IN11
ADC_IN12: J3.111 ; port ADC_IN12
ADC_IN13: J3.115 ; port ADC_IN13
ADC_IN14: J3.53 ; port ADC_IN14
ADC_IN15: J3.57 ; port ADC_IN15
CMP_IN1: J3.116 R122.1 U24.3(INA+) U24.6(INB-)
COOLER_EN: Q3.1(G) U24.1(OUTA)
COOLER_SW: C268.1 C269.1 C270.1 C271.1 C272.1 C273.1 J3.157 J3.159 J3.161 J3.163 J3.165 J3.167 J3.169 J3.171 J3.173 J3.175 J3.177 J3.179 Q3.3(D)
DAC_OUT1: J3.3 U24.2(INA-) ; port DAC_OUT1
DAC_OUT2: J3.7 U24.5(INB+) ; port DAC_OUT2
DAC_OUT3: J3.11 ; port DAC_OUT3
DAC_OUT4: J3.15 ; port DAC_OUT4
DAC_OUT5: J3.19 ; port DAC_OUT5
DAC_OUT6: J3.23 ; port DAC_OUT6
DAC_OUT7: J3.27 ; port DAC_OUT7
DAC_OUT8: J3.31 ; port DAC_OUT8
DAC_OUT9: J3.35 ; port DAC_OUT9
DAC_OUT10: J3.39 ; port DAC_OUT10
HEATER_EN: Q2.1(G) U24.7(OUTB)
HEATER_SW: C262.1 C263.1 C264.1 C265.1 C266.1 C267.1 J3.189 J3.190 J3.191 J3.192 Q2.3(D)

Not connected (* = marked no-connect by the designer): J3 43* 45*

### Layout directives
net class Diff_AD: (no net found under the mark)

### Notes on the sheet
- Deticated ADC
- Comparator for Temp Ctrl
- BANK35 - XADC
- 1/4.096 divider ratio
- External DAC
- External ADC
- Drain & source tracks must support 10A continuous current for Q2 and Q3.
- Q2 and Q3 should be placed as close as possible to J3.
- REV.
- DESCRIPTION
- DATE
- APPROVED
- Incal Inc.
- SHEET
- TITLE
- CONFIG.
- PROJECT
- SIZE
- SCH P/N.
- DRAWN
- B
- OF
- (in symbol MAX9019EKA+T) +; -

### Library data of the parts
C247 = C0402_0.1uF_10%_16V_X7R: Capacitor ceramic, X7R, 0.1uF, 16V, 10%, -55 to +125 C, EIA0402; Manufacturer 1: Murata; Mfg Part Number 1: GRM155R71C104KA88D; EIA(I) Package: 0402; EIA(M) Package: 1005; ASSY: USED; Status: Active; Power: *; Current: *; Part Ref: C0402_0.1uF_10%_16V_X7R; Comment_1: *; RoHs: True; Tolerance: 10%; Operating Temp: -55 to +125 C; Datasheet 1: ..\datasheet\Capacitor\Murata\GRM_Serie\GRM188R72A_X7R\2012-06-24
C248 = C0603_10uF_10%_10V_X5R: as C72 on sheet FPGAPower; Status: Active; Power: *; Current: *; Part Ref: C0603_10uF_10%_10V_X5R; Comment_1: *; RoHs: True; Tolerance: 10%; Operating Temp: -55 to +85 C
C262-C273 = C0603_0.1uF_10%_100V_X7R: Capacitor ceramic, X7R, 0.1uF, 100V, 10%, -55 to +125 C, EIA0603; Manufacturer 1: Murata; Mfg Part Number 1: GRM188R72A104KA35D; EIA(I) Package: 0603; EIA(M) Package: 1608; ASSY: USED; Status: Active; Power: *; Current: *; Part Ref: C0603_0.1uF_10%_100V_X7R; Comment_1: *; RoHs: True; Operating Temp: -55 to +125 C; Datasheet 1: ..\datasheet\Capacitor\Murata\GRM_Serie\GRM188R72A_X7R\2012-06-24
J3 = QTH-090-01-L-D-A: Connector Header HS .5mm 180 pin DL AU; Manufacturer 1: Samtec; PART NUMBER: QTH-090-01-L-D-A; Part Ref: QTH-090-01-L-D-A; RoHs: True; Value: QTH-090-01-L-D-A; Mfg Part Number 1: QTH-090-01-L-D-A
NT1 = NET_TIE_1X1: Net Tie 1 to 1; ASSY: USED; Status: Active; Power: *; Current: *; EIA(I) Package: *; EIA(M) Package: *; Part Ref: NET_TIE_1X1; Comment_1: *; RoHs: True; Value: NET_TIE; Tolerance: *; Voltage: *
Q2 Q3 = STD16NF06LT4: Transistor MOSFET, N-Channel, TO-252, 60V, 24A, 40W, TO-263; Manufacturer 1: ST Microelectronics; Status: Active; EIA(I) Package: *; EIA(M) Package: *; Part Ref: STD16NF06LT4; Power: 40W; Current: 24A; Tolerance: *; Voltage: 60V; Package: TO-263; RoHs: True; Datasheet 1: https://media.digikey.com/pdf/Data%20Sheets/ST%20Microelectronics%20PDFS/STD16NF06L_-1_Rev_5.pdf; Mfg Part Number 1: STD16NF06LT4; Operating Temp: -55 to +175 C
R122 = R0402_3k74_0.1%: Resistor, 3k74, 1/16W, 0.1%, -50 to +155 C, EIA0402, EIA(M)1005; Manufacturer 1: Panasonic; Mfg Part Number 1: ERA-2AEB3741X; EIA(I) Package: 0402; EIA(M) Package: 1005; Voltage: 50V; ASSY: USED; Status: Active; Part Ref: R0402_3k74_0.1%; Current: *; Comment_1: *; RoHs: True; Operating Temp: -50 to +155 C
R130 = R0402_1k24_0.1%: Resistor, 1k24, 1/16W, 0.1%, -50 to +155 C, EIA0402, EIA(M)1005; Manufacturer 1: Panasonic; Mfg Part Number 1: ERA-2AEB1241X; EIA(I) Package: 0402; EIA(M) Package: 1005; Voltage: 50V; ASSY: USED; Status: Active; Part Ref: R0402_1k24_0.1%; Current: *; Comment_1: *; RoHs: True; Operating Temp: -50 to +155 C
U24 = MAX9019EKA+T: Comparator, Dual, Push-pull, 1.8V to 5.5V, 50mA, -40 to +85 C, , SOT-23-8; Manufacturer 1: Maxim; ASSY: USED; Power: Pow; Comment_1: Com; Status: Active; EIA(I) Package: *; EIA(M) Package: *; Part Ref: MAX9019EKA+T; Current: 50mA; Tolerance: *; Voltage: 1.8V to 5.5V; Package: SOT-23-8; RoHs: True; Operating Temp: -40 to +85 C; Mfg Part Number 1: MAX9019EKA+T

## Sheet HeaderB.SchDoc: 02290_Sonoma_Controller
size B; ApprovedBy: J Johnson; CheckedBy: J Johnson; Author: sdfasdfdfAEFfasdFfaF; DrawnBy: J Johnson; Organization: Opsero Electronic Design; Address1: 21-915 Av. Marguerite-Bourgeoys; Address2: Québec (QC); Address3: G1S 3X4; DocumentNumber: OP009-001-SCH; Revision: D-1; SheetNumber: 10; SheetTotal: 16; Tel1: (581) 308-8830; Tel2: (581) 308-8830; Project: 02290_Sonoma_Controller; CheckedDate: yyyy-mm-dd; Sheet: Header B; PageSetup: Record=PageOptions|CenterHorizontal=True|CenterVertical=True|PrintScale=1.08|XCorrection=1.00|YCorrection=1.00|PrintKind=0|BorderSize=5000000|LeftOffset=0|BottomOffset=0|Orientation=2|PaperLength=1000|PaperWidth=1000|Scale=100|PaperSource=7|PrintQuality=-4|MediaType=1|DitherType=10|PaperKind=Tabloid     [11 x 17 in]|PrintScaleMode=1; DrawDate: 2013-12-13; SchTitle: 02290_Sonoma_Controller; RevDescription: Replaced Q2,Q3 with STD16NF06LT4; RevDate: 2020-07-07; RevBy: J Johnson; RevDescription2: Added resistors to QSPI interface; ModifiedDate: 2020-07-07
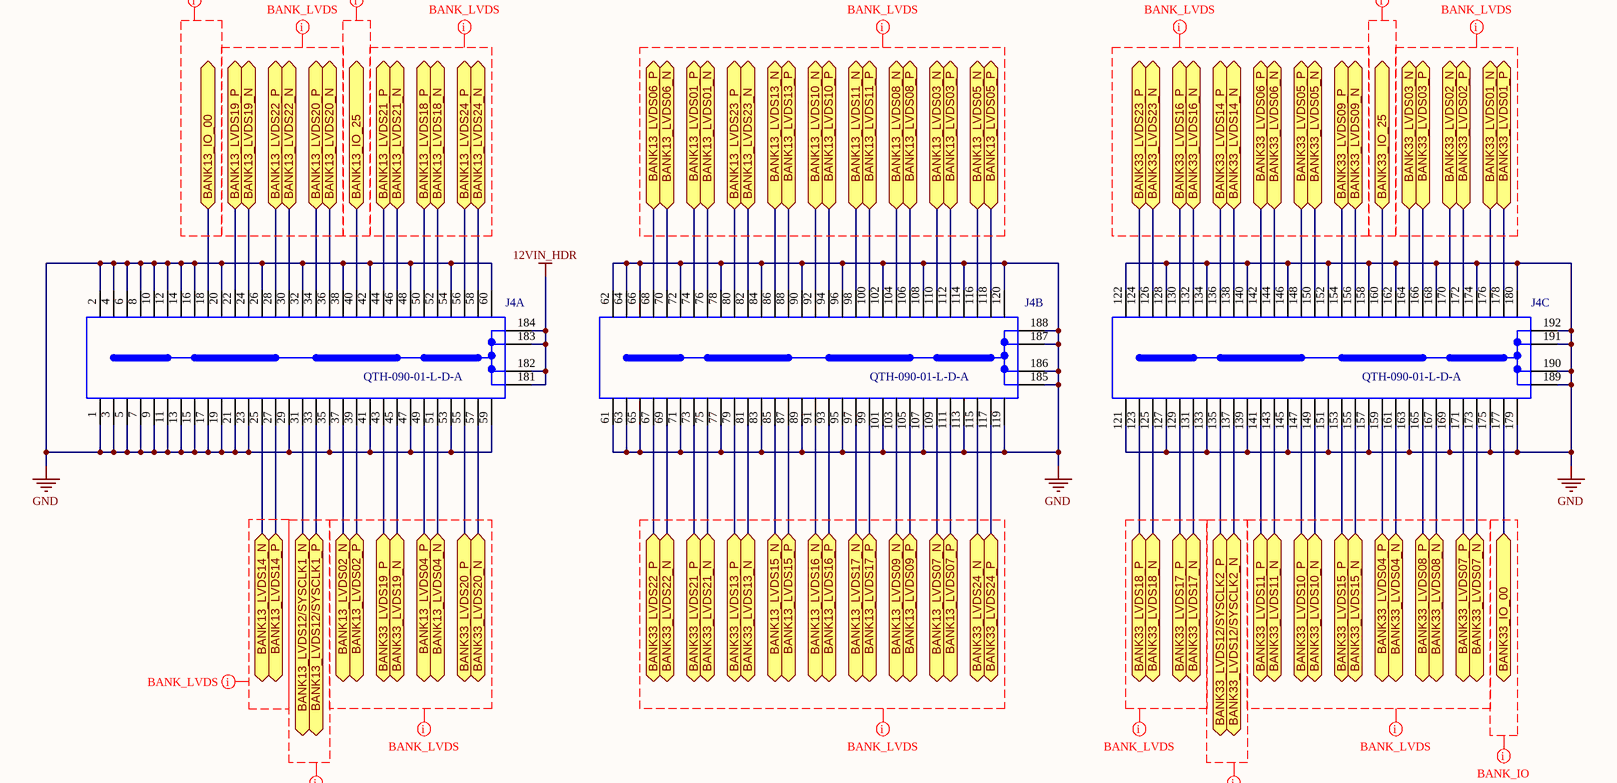
[diagram p10: HeaderB.SchDoc]

### Parts
J4  QTH-090-01-L-D-A  [QTH-090-01-L-D-A]  (parts A,B,C of 3)

### Ports
BANK13_IO_00 (bidir), BANK13_IO_25 (bidir), BANK13_LVDS01_N (bidir), BANK13_LVDS01_P (bidir), BANK13_LVDS02_N (bidir), BANK13_LVDS02_P (bidir), BANK13_LVDS03_N (bidir), BANK13_LVDS03_P (bidir), BANK13_LVDS04_N (bidir), BANK13_LVDS04_P (bidir), BANK13_LVDS05_N (bidir), BANK13_LVDS05_P (bidir), BANK13_LVDS06_N (bidir), BANK13_LVDS06_P (bidir), BANK13_LVDS07_N (bidir), BANK13_LVDS07_P (bidir), BANK13_LVDS08_N (bidir), BANK13_LVDS08_P (bidir), BANK13_LVDS09_N (bidir), BANK13_LVDS09_P (bidir), BANK13_LVDS10_N (bidir), BANK13_LVDS10_P (bidir), BANK13_LVDS11_N (bidir), BANK13_LVDS11_P (bidir), BANK13_LVDS12/SYSCLK1_N (bidir), BANK13_LVDS12/SYSCLK1_P (bidir), BANK13_LVDS13_N (bidir), BANK13_LVDS13_P (bidir), BANK13_LVDS14_N (bidir), BANK13_LVDS14_P (bidir), BANK13_LVDS15_N (bidir), BANK13_LVDS15_P (bidir), BANK13_LVDS16_N (bidir), BANK13_LVDS16_P (bidir), BANK13_LVDS17_N (bidir), BANK13_LVDS17_P (bidir), BANK13_LVDS18_N (bidir), BANK13_LVDS18_P (bidir), BANK13_LVDS19_N (bidir), BANK13_LVDS19_P (bidir), BANK13_LVDS20_N (bidir), BANK13_LVDS20_P (bidir), BANK13_LVDS21_N (bidir), BANK13_LVDS21_P (bidir), BANK13_LVDS22_N (bidir), BANK13_LVDS22_P (bidir), BANK13_LVDS23_N (bidir), BANK13_LVDS23_P (bidir), BANK13_LVDS24_N (bidir), BANK13_LVDS24_P (bidir), BANK33_IO_00 (bidir), BANK33_IO_25 (bidir), BANK33_LVDS01_N (bidir), BANK33_LVDS01_P (bidir), BANK33_LVDS02_N (bidir), BANK33_LVDS02_P (bidir), BANK33_LVDS03_N (bidir), BANK33_LVDS03_P (bidir), BANK33_LVDS04_N (bidir), BANK33_LVDS04_P (bidir), BANK33_LVDS05_N (bidir), BANK33_LVDS05_P (bidir), BANK33_LVDS06_N (bidir), BANK33_LVDS06_P (bidir), BANK33_LVDS07_N (bidir), BANK33_LVDS07_P (bidir), BANK33_LVDS08_N (bidir), BANK33_LVDS08_P (bidir), BANK33_LVDS09_N (bidir), BANK33_LVDS09_P (bidir), BANK33_LVDS10_N (bidir), BANK33_LVDS10_P (bidir), BANK33_LVDS11_N (bidir), BANK33_LVDS11_P (bidir), BANK33_LVDS12/SYSCLK2_N (bidir), BANK33_LVDS12/SYSCLK2_P (bidir), BANK33_LVDS13_N (bidir), BANK33_LVDS13_P (bidir), BANK33_LVDS14_N (bidir), BANK33_LVDS14_P (bidir), BANK33_LVDS15_N (bidir), BANK33_LVDS15_P (bidir), BANK33_LVDS16_N (bidir), BANK33_LVDS16_P (bidir), BANK33_LVDS17_N (bidir), BANK33_LVDS17_P (bidir), BANK33_LVDS18_N (bidir), BANK33_LVDS18_P (bidir), BANK33_LVDS19_N (bidir), BANK33_LVDS19_P (bidir), BANK33_LVDS20_N (bidir), BANK33_LVDS20_P (bidir), BANK33_LVDS21_N (bidir), BANK33_LVDS21_P (bidir), BANK33_LVDS22_N (bidir), BANK33_LVDS22_P (bidir), BANK33_LVDS23_N (bidir), BANK33_LVDS23_P (bidir), BANK33_LVDS24_N (bidir), BANK33_LVDS24_P (bidir)

### Nets
12VIN_HDR: J4.181 J4.182 J4.183 J4.184
GND: J4.1 J4.2 J4.3 J4.4 J4.5 J4.6 J4.7 J4.8 J4.9 J4.10 J4.11 J4.12 J4.13 J4.14 J4.15 J4.16 J4.17 J4.19 J4.20 J4.21 J4.23 J4.26 J4.29 J4.32 J4.35 J4.38 J4.41 J4.42 J4.47 J4.48 J4.53 J4.54 J4.59 J4.60 J4.61 J4.62 J4.63 J4.64 J4.65 J4.66 J4.71 J4.72 J4.77 J4.78 J4.83 J4.84 J4.89 J4.90 J4.95 J4.96 J4.101 J4.102 J4.107 J4.108 J4.113 J4.114 J4.119 J4.120 J4.121 J4.122 J4.127 J4.128 J4.133 J4.134 J4.139 J4.140 J4.145 J4.146 J4.151 J4.152 J4.157 J4.158 J4.162 J4.163 J4.168 J4.169 J4.174 J4.175 J4.179 J4.180 J4.185 J4.186 J4.187 J4.188 J4.189 J4.190 J4.191 J4.192
BANK13_IO_00: J4.18 ; port BANK13_IO_00
BANK13_IO_25: J4.40 ; port BANK13_IO_25
BANK13_LVDS01_N: J4.76 ; port BANK13_LVDS01_N
BANK13_LVDS01_P: J4.74 ; port BANK13_LVDS01_P
BANK13_LVDS02_N: J4.37 ; port BANK13_LVDS02_N
BANK13_LVDS02_P: J4.39 ; port BANK13_LVDS02_P
BANK13_LVDS03_N: J4.110 ; port BANK13_LVDS03_N
BANK13_LVDS03_P: J4.112 ; port BANK13_LVDS03_P
BANK13_LVDS04_N: J4.51 ; port BANK13_LVDS04_N
BANK13_LVDS04_P: J4.49 ; port BANK13_LVDS04_P
BANK13_LVDS05_N: J4.116 ; port BANK13_LVDS05_N
BANK13_LVDS05_P: J4.118 ; port BANK13_LVDS05_P
BANK13_LVDS06_N: J4.70 ; port BANK13_LVDS06_N
BANK13_LVDS06_P: J4.68 ; port BANK13_LVDS06_P
BANK13_LVDS07_N: J4.109 ; port BANK13_LVDS07_N
BANK13_LVDS07_P: J4.111 ; port BANK13_LVDS07_P
BANK13_LVDS08_N: J4.104 ; port BANK13_LVDS08_N
BANK13_LVDS08_P: J4.106 ; port BANK13_LVDS08_P
BANK13_LVDS09_N: J4.103 ; port BANK13_LVDS09_N
BANK13_LVDS09_P: J4.105 ; port BANK13_LVDS09_P
BANK13_LVDS10_N: J4.92 ; port BANK13_LVDS10_N
BANK13_LVDS10_P: J4.94 ; port BANK13_LVDS10_P
BANK13_LVDS11_N: J4.98 ; port BANK13_LVDS11_N
BANK13_LVDS11_P: J4.100 ; port BANK13_LVDS11_P
BANK13_LVDS12/SYSCLK1_N: J4.31 ; port BANK13_LVDS12/SYSCLK1_N
BANK13_LVDS12/SYSCLK1_P: J4.33 ; port BANK13_LVDS12/SYSCLK1_P
BANK13_LVDS13_N: J4.86 ; port BANK13_LVDS13_N
BANK13_LVDS13_P: J4.88 ; port BANK13_LVDS13_P
BANK13_LVDS14_N: J4.25 ; port BANK13_LVDS14_N
BANK13_LVDS14_P: J4.27 ; port BANK13_LVDS14_P
BANK13_LVDS15_N: J4.85 ; port BANK13_LVDS15_N
BANK13_LVDS15_P: J4.87 ; port BANK13_LVDS15_P
BANK13_LVDS16_N: J4.91 ; port BANK13_LVDS16_N
BANK13_LVDS16_P: J4.93 ; port BANK13_LVDS16_P
BANK13_LVDS17_N: J4.97 ; port BANK13_LVDS17_N
BANK13_LVDS17_P: J4.99 ; port BANK13_LVDS17_P
BANK13_LVDS18_N: J4.52 ; port BANK13_LVDS18_N
BANK13_LVDS18_P: J4.50 ; port BANK13_LVDS18_P
BANK13_LVDS19_N: J4.24 ; port BANK13_LVDS19_N
BANK13_LVDS19_P: J4.22 ; port BANK13_LVDS19_P
BANK13_LVDS20_N: J4.36 ; port BANK13_LVDS20_N
BANK13_LVDS20_P: J4.34 ; port BANK13_LVDS20_P
BANK13_LVDS21_N: J4.46 ; port BANK13_LVDS21_N
BANK13_LVDS21_P: J4.44 ; port BANK13_LVDS21_P
BANK13_LVDS22_N: J4.30 ; port BANK13_LVDS22_N
BANK13_LVDS22_P: J4.28 ; port BANK13_LVDS22_P
BANK13_LVDS23_N: J4.82 ; port BANK13_LVDS23_N
BANK13_LVDS23_P: J4.80 ; port BANK13_LVDS23_P
BANK13_LVDS24_N: J4.58 ; port BANK13_LVDS24_N
BANK13_LVDS24_P: J4.56 ; port BANK13_LVDS24_P
BANK33_IO_00: J4.177 ; port BANK33_IO_00
BANK33_IO_25: J4.160 ; port BANK33_IO_25
BANK33_LVDS01_N: J4.176 ; port BANK33_LVDS01_N
BANK33_LVDS01_P: J4.178 ; port BANK33_LVDS01_P
BANK33_LVDS02_N: J4.170 ; port BANK33_LVDS02_N
BANK33_LVDS02_P: J4.172 ; port BANK33_LVDS02_P
BANK33_LVDS03_N: J4.164 ; port BANK33_LVDS03_N
BANK33_LVDS03_P: J4.166 ; port BANK33_LVDS03_P
BANK33_LVDS04_N: J4.161 ; port BANK33_LVDS04_N
BANK33_LVDS04_P: J4.159 ; port BANK33_LVDS04_P
BANK33_LVDS05_N: J4.150 ; port BANK33_LVDS05_N
BANK33_LVDS05_P: J4.148 ; port BANK33_LVDS05_P
BANK33_LVDS06_N: J4.144 ; port BANK33_LVDS06_N
BANK33_LVDS06_P: J4.142 ; port BANK33_LVDS06_P
BANK33_LVDS07_N: J4.173 ; port BANK33_LVDS07_N
BANK33_LVDS07_P: J4.171 ; port BANK33_LVDS07_P
BANK33_LVDS08_N: J4.167 ; port BANK33_LVDS08_N
BANK33_LVDS08_P: J4.165 ; port BANK33_LVDS08_P
BANK33_LVDS09_N: J4.156 ; port BANK33_LVDS09_N
BANK33_LVDS09_P: J4.154 ; port BANK33_LVDS09_P
BANK33_LVDS10_N: J4.149 ; port BANK33_LVDS10_N
BANK33_LVDS10_P: J4.147 ; port BANK33_LVDS10_P
BANK33_LVDS11_N: J4.143 ; port BANK33_LVDS11_N
BANK33_LVDS11_P: J4.141 ; port BANK33_LVDS11_P
BANK33_LVDS12/SYSCLK2_N: J4.137 ; port BANK33_LVDS12/SYSCLK2_N
BANK33_LVDS12/SYSCLK2_P: J4.135 ; port BANK33_LVDS12/SYSCLK2_P
BANK33_LVDS13_N: J4.81 ; port BANK33_LVDS13_N
BANK33_LVDS13_P: J4.79 ; port BANK33_LVDS13_P
BANK33_LVDS14_N: J4.138 ; port BANK33_LVDS14_N
BANK33_LVDS14_P: J4.136 ; port BANK33_LVDS14_P
BANK33_LVDS15_N: J4.155 ; port BANK33_LVDS15_N
BANK33_LVDS15_P: J4.153 ; port BANK33_LVDS15_P
BANK33_LVDS16_N: J4.132 ; port BANK33_LVDS16_N
BANK33_LVDS16_P: J4.130 ; port BANK33_LVDS16_P
BANK33_LVDS17_N: J4.131 ; port BANK33_LVDS17_N
BANK33_LVDS17_P: J4.129 ; port BANK33_LVDS17_P
BANK33_LVDS18_N: J4.125 ; port BANK33_LVDS18_N
BANK33_LVDS18_P: J4.123 ; port BANK33_LVDS18_P
BANK33_LVDS19_N: J4.45 ; port BANK33_LVDS19_N
BANK33_LVDS19_P: J4.43 ; port BANK33_LVDS19_P
BANK33_LVDS20_N: J4.57 ; port BANK33_LVDS20_N
BANK33_LVDS20_P: J4.55 ; port BANK33_LVDS20_P
BANK33_LVDS21_N: J4.75 ; port BANK33_LVDS21_N
BANK33_LVDS21_P: J4.73 ; port BANK33_LVDS21_P
BANK33_LVDS22_N: J4.69 ; port BANK33_LVDS22_N
BANK33_LVDS22_P: J4.67 ; port BANK33_LVDS22_P
BANK33_LVDS23_N: J4.126 ; port BANK33_LVDS23_N
BANK33_LVDS23_P: J4.124 ; port BANK33_LVDS23_P
BANK33_LVDS24_N: J4.115 ; port BANK33_LVDS24_N
BANK33_LVDS24_P: J4.117 ; port BANK33_LVDS24_P

### Layout directives
net class BANK_LVDS: (no net found under the mark)
net class BANK_LVDS_SYSCLK: (no net found under the mark)
net class BANK_IO: (no net found under the mark)

### Notes on the sheet
- REV.
- DESCRIPTION
- DATE
- APPROVED
- Incal Inc.
- SHEET
- TITLE
- CONFIG.
- PROJECT
- SIZE
- SCH P/N.
- DRAWN
- B
- OF

### Library data of the parts
J4 = QTH-090-01-L-D-A: as J3 on sheet HeaderA; PART NUMBER: QTH-090-01-L-D-A; Part Ref: QTH-090-01-L-D-A; RoHs: True; Value: QTH-090-01-L-D-A; Mfg Part Number 1: QTH-090-01-L-D-A